# EAGLE schematic GBA_EMU (EAGLE 9.3.0)
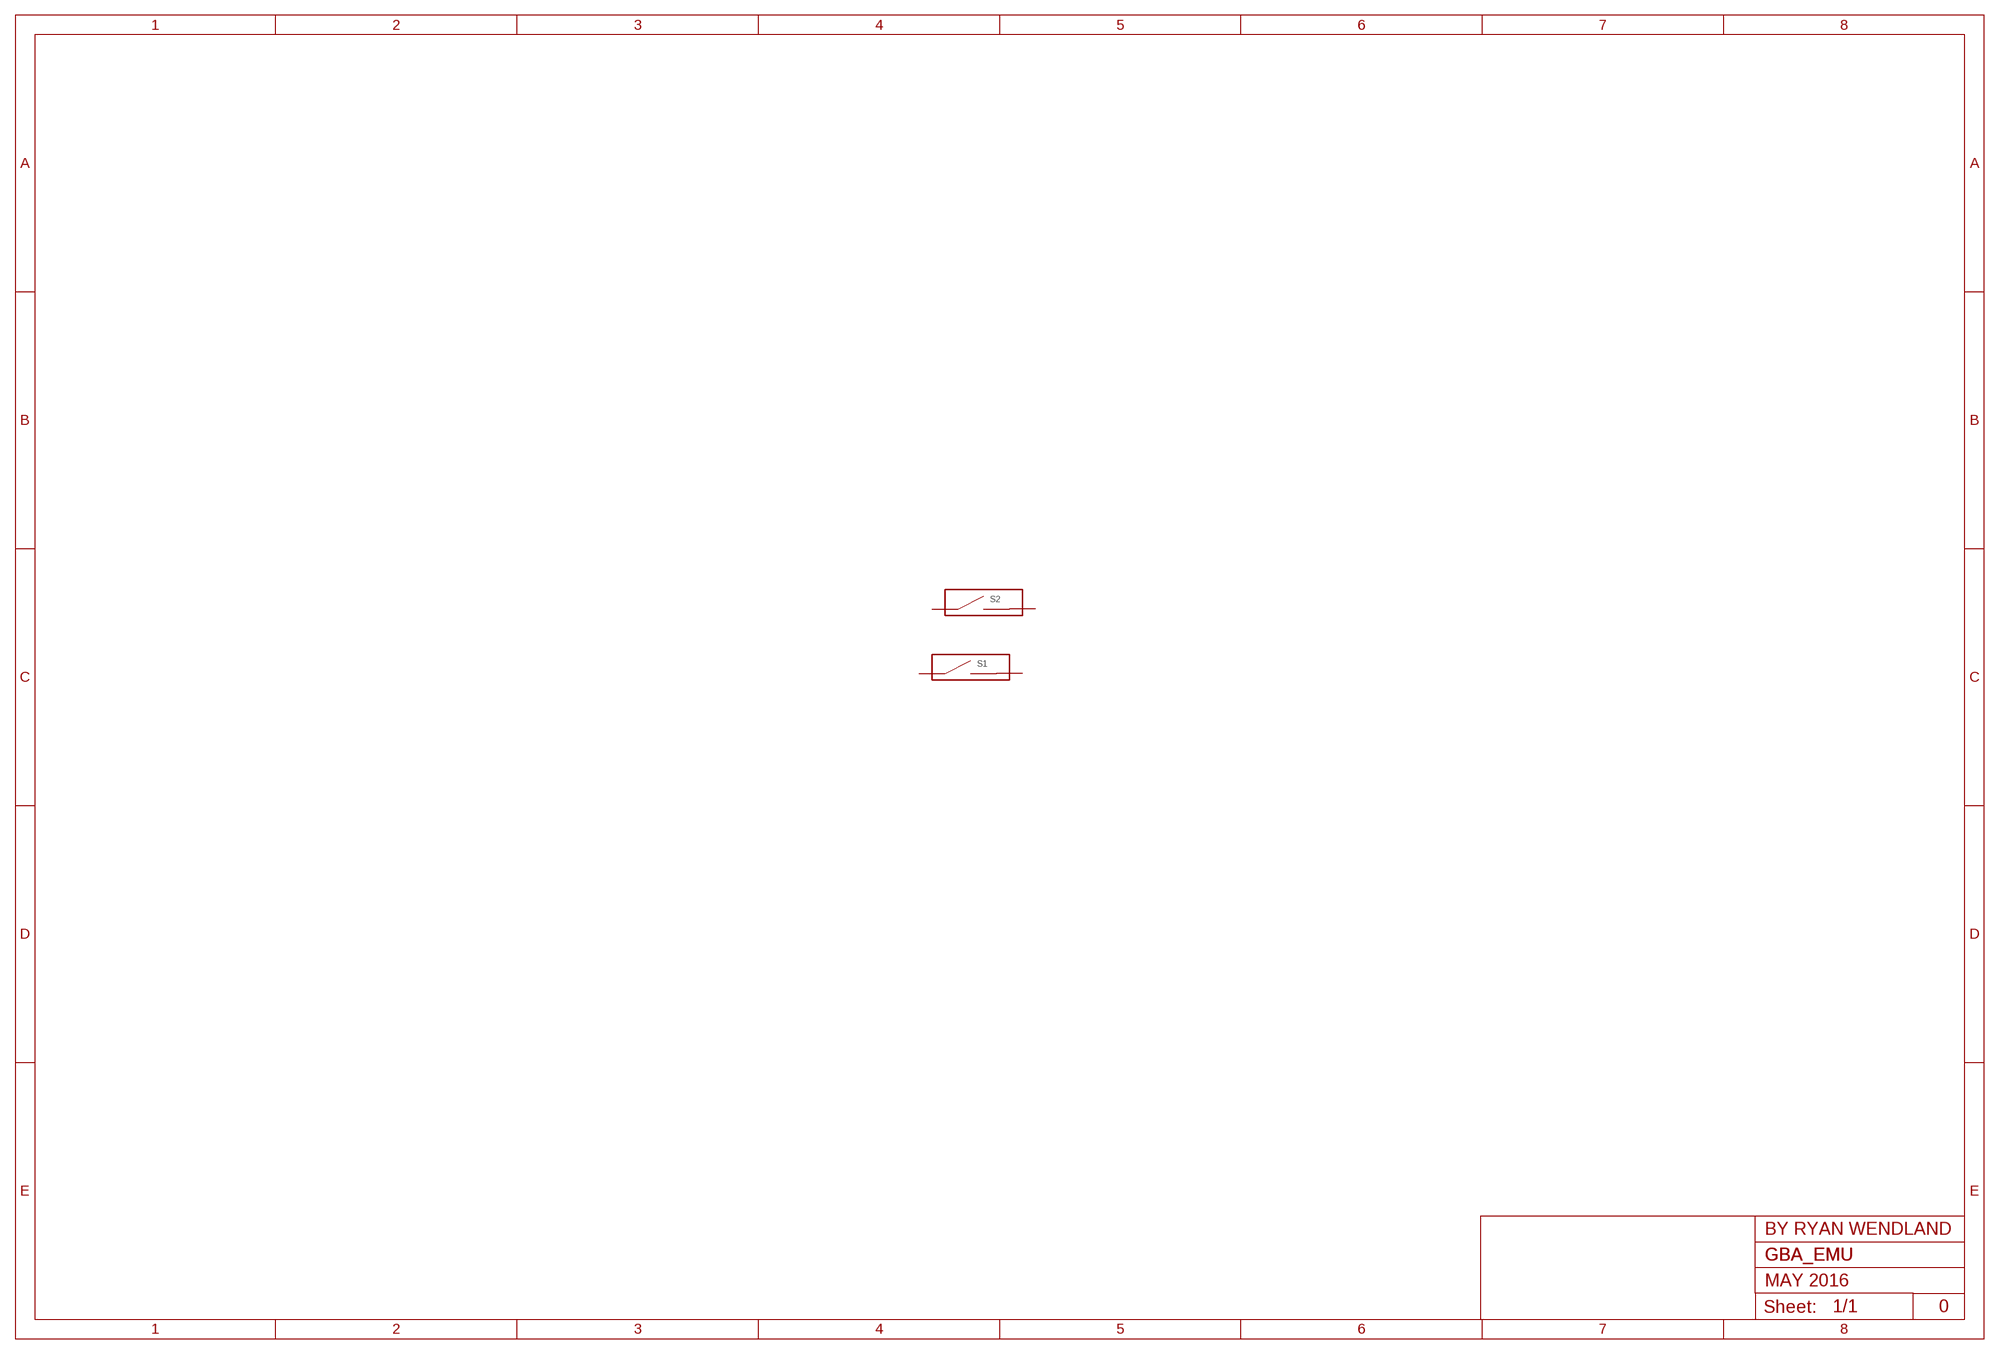
[diagram p0: schematic, sheet 1]

## Parts
S1  SHOULDER_BUTTON  [SHOULDER_BUTTON]
S2  SHOULDER_BUTTON  [SHOULDER_BUTTON]
Unconnected: S1.GND@1 S1.GND@2 S1.GND@3 S1.SW S2.GND@1 S2.GND@2 S2.GND@3 S2.SW

## Notes on the sheet
- BY RYAN WENDLAND
- GBA_EMU
- MAY 2016
- 0

## Library data of the parts
S1 S2 = gba-zero-parts:SHOULDER_BUTTON